# EAGLE schematic preliminarySchematic (EAGLE 9.6.2)
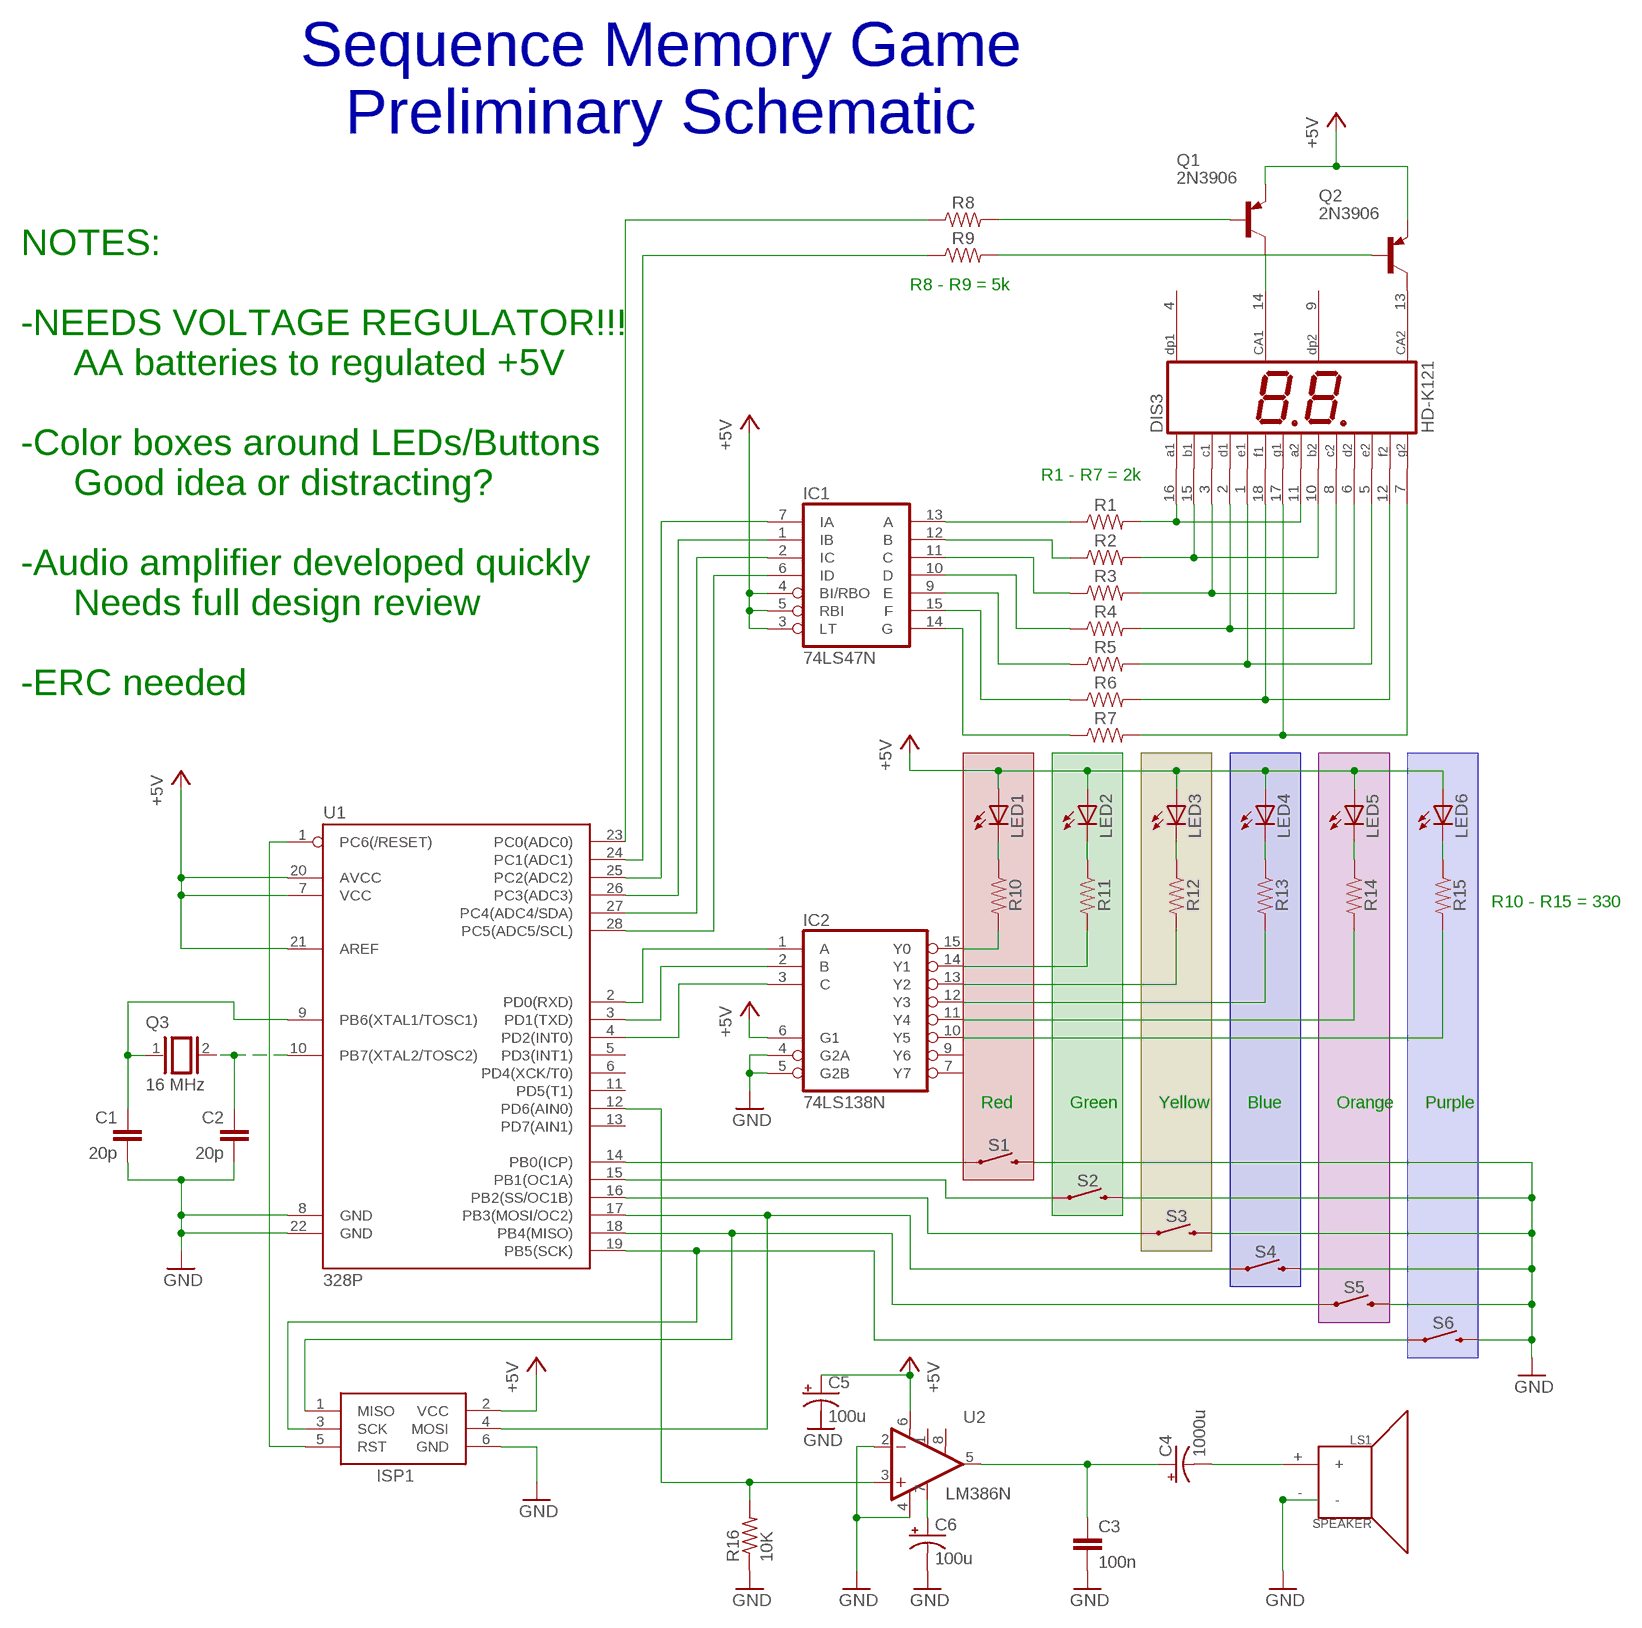
[diagram p0: schematic, sheet 1]

## Parts
C1  20p  C2,5-3  [C2.5-3]
C2  20p  C2,5-3  [C2.5-3]
C3  100n  C2,5-3  [C2.5-3]
C4  1000u  CPOL-USE5-10.5  [E5-10,5]
C5  100u  CPOL-USE2.5-6  [E2,5-6]
C6  100u  CPOL-USE2.5-6  [E2,5-6]
DIS3  HD-K121  [HDSP-R]
IC1  74LS47N  [DIL16]
IC2  74LS138N  [DIL16]
ISP1  AVRISP-6  [AVRISP]
LED1  LED5MM  [LED5MM]
LED2  LED5MM  [LED5MM]
LED3  LED5MM  [LED5MM]
LED4  LED5MM  [LED5MM]
LED5  LED5MM  [LED5MM]
LED6  LED5MM  [LED5MM]
LS1  SPEAKER  [PCB_MOUNT_SPEAKER]
Q1  2N3906  [TO92]
Q2  2N3906  [TO92]
Q3  XTAL/S  [QS]
R1  RESISTORAXIAL-0.3  [AXIAL-0.3]
R2  RESISTORAXIAL-0.3  [AXIAL-0.3]
R3  RESISTORAXIAL-0.3  [AXIAL-0.3]
R4  RESISTORAXIAL-0.3  [AXIAL-0.3]
R5  RESISTORAXIAL-0.3  [AXIAL-0.3]
R6  RESISTORAXIAL-0.3  [AXIAL-0.3]
R7  RESISTORAXIAL-0.3  [AXIAL-0.3]
R8  RESISTORAXIAL-0.3  [AXIAL-0.3]
R9  RESISTORAXIAL-0.3  [AXIAL-0.3]
R10  RESISTORAXIAL-0.3  [AXIAL-0.3]
R11  RESISTORAXIAL-0.3  [AXIAL-0.3]
R12  RESISTORAXIAL-0.3  [AXIAL-0.3]
R13  RESISTORAXIAL-0.3  [AXIAL-0.3]
R14  RESISTORAXIAL-0.3  [AXIAL-0.3]
R15  RESISTORAXIAL-0.3  [AXIAL-0.3]
R16  10K  R-US_0204/5  [0204/5]
S1  MOMENTARY-SWITCH-SPST-PTH-6.0MM  [TACTILE_SWITCH_PTH_6.0MM]
S2  MOMENTARY-SWITCH-SPST-PTH-6.0MM  [TACTILE_SWITCH_PTH_6.0MM]
S3  MOMENTARY-SWITCH-SPST-PTH-6.0MM  [TACTILE_SWITCH_PTH_6.0MM]
S4  MOMENTARY-SWITCH-SPST-PTH-6.0MM  [TACTILE_SWITCH_PTH_6.0MM]
S5  MOMENTARY-SWITCH-SPST-PTH-6.0MM  [TACTILE_SWITCH_PTH_6.0MM]
S6  MOMENTARY-SWITCH-SPST-PTH-6.0MM  [TACTILE_SWITCH_PTH_6.0MM]
U1  328P  ATMEGA328P_PDIP  [DIP28]
U2  LM386N  LM386  [DIP08]

## Nets
+5V: C5.+ IC1.3(LT) IC1.4(BI/RBO) IC1.5(RBI) IC2.6(G1) ISP1.2(VCC) LED1.A LED2.A LED3.A LED4.A LED5.A LED6.A Q1.3(E) Q2.3(E) U1.7(VCC) U1.20(AVCC) U1.21(AREF) U2.6(V+)
GND: C1.2 C2.2 C3.2 C6.- IC2.4(G2A) IC2.5(G2B) ISP1.6(GND) LS1.- R16.1 S1.3 S2.3 S3.3 S4.3 S5.3 S6.3 U1.8(GND) U1.22(GND) U2.2(-IN) U2.4(V-)
N$1: DIS3.10(B2) DIS3.11(A2) DIS3.16(A1) R1.P$2 R2.P$2
N$2: DIS3.15(B1)
N$3: DIS3.3(C1) DIS3.8(C2) R3.P$2
N$4: DIS3.2(D1) DIS3.6(D2) R4.P$2
N$5: DIS3.1(E1) DIS3.5(E2) R5.P$2
N$6: DIS3.7(G2) DIS3.12(F2) DIS3.17(G1) DIS3.18(F1) IC1.14(G) IC1.15(F) R6.P$1 R6.P$2 R7.P$1 R7.P$2
N$7: IC1.13(A) R1.P$1
N$8: IC1.12(B) R2.P$1
N$9: IC1.11(C) R3.P$1
N$10: IC1.10(D) R4.P$1
N$11: IC1.9(E) R5.P$1
N$12: DIS3.14(CA1) Q1.1(C)
N$13: DIS3.13(CA2) Q2.1(C)
N$14: Q1.2(B) R8.P$2
N$15: Q2.2(B) R9.P$2
N$16: C2.1 Q3.2 U1.10(PB7(XTAL2/TOSC2))
N$17: IC2.15(Y0) R10.P$2
N$18: IC2.14(Y1) R11.P$2
N$19: IC2.13(Y2) R12.P$2
N$20: IC2.12(Y3) R13.P$2
N$21: IC2.11(Y4) R14.P$2
N$22: IC2.10(Y5) R15.P$2
N$23: C1.1 Q3.1 U1.9(PB6(XTAL1/TOSC1))
N$24: LED1.K(C) R10.P$1
N$25: LED2.K(C) R11.P$1
N$26: LED3.K(C) R12.P$1
N$27: LED4.K(C) R13.P$1
N$28: LED5.K(C) R14.P$1
N$29: LED6.K(C) R15.P$1
N$31: S1.1 U1.14(PB0(ICP))
N$32: R16.2 U1.12(PD6(AIN0)) U2.3(+IN)
N$33: ISP1.3(SCK) S6.1 U1.19(PB5(SCK))
N$34: ISP1.5(RST) U1.1(PC6(/RESET))
N$35: IC2.1(A) U1.2(PD0(RXD))
N$36: IC2.3(C) U1.4(PD2(INT0))
N$37: ISP1.1(MISO) S5.1 U1.18(PB4(MISO))
N$38: S2.1 U1.15(PB1(OC1A))
N$39: IC2.2(B) U1.3(PD1(TXD))
N$40: C6.+ U2.7(BP)
N$41: S3.1 U1.16(PB2(SS/OC1B))
N$42: R8.P$1 U1.23(PC0(ADC0))
N$43: ISP1.4(MOSI) S4.1 U1.17(PB3(MOSI/OC2))
N$44: R9.P$1 U1.24(PC1(ADC1))
N$45: IC1.7(IA) U1.25(PC2(ADC2))
N$46: C3.1 C4.+ U2.5(OUT)
N$47: IC1.1(IB) U1.26(PC3(ADC3))
N$48: IC1.2(IC) U1.27(PC4(ADC4/SDA))
N$49: IC1.6(ID) U1.28(PC5(ADC5/SCL))
N$50: C4.- LS1.+
Unconnected: C5.- DIS3.4(DP1) DIS3.9(DP2) IC2.7(Y7) IC2.9(Y6) U1.5(PD3(INT1)) U1.6(PD4(XCK/T0)) U1.11(PD5(T1)) U1.13(PD7(AIN1)) U2.1(GAIN) U2.8(GAIN)

## Notes on the sheet
- Sequence Memory Game
  Preliminary Schematic
- R8 - R9 = 5k
- R1 - R7 = 2k
- NOTES:
  
  -NEEDS VOLTAGE REGULATOR!!!
       AA batteries to regulated +5V
  
  -Color boxes around LEDs/Buttons
       Good idea or distracting?
  
  -Audio amplifier developed quickly
       Needs full design review
  
  -ERC needed
- R10 - R15 = 330
- Red | Green | Yellow | Blue | Orange | Purple

## Power pins joined to a net without a drawn wire
GND: IC1.8(GND) IC2.8(GND)
VCC: IC1.16(VCC) IC2.16(VCC)

## Library data of the parts
C1-C3 = capacitor-wima:C: CAPACITOR naming: grid - package width
C4-C6 = rcl:CPOL-US: POLARIZED CAPACITOR, American symbol; SPICEPREFIX: C
DIS3 = display-hp:HD-K121: LED DISPLAY 2 x 1 character 7 segment, decimal points right; OC_FARNELL: unknown; OC_NEWARK: unknown
IC1 = 74xx-us:74*47: BCD to seven segment DECODER/DRIVER Source: http://www.ee.washington.edu/stores/DataSheets/74ls/74ls47.pdf
IC2 = 74xx-us:74*138: 3-line to 8-line DECODER/DEMULTIPLEXER
ISP1 = adafruit:AVRISP: AVR ISP HEADER Standard 6 pin header for AVR programming
LED1-LED6 = adafruit:LED: LED OSRAM: - CHIPLED LG R971, LG N971, LY N971, LG Q971, LY Q971, LO R971, LY R971 LH N974, LH R974 LS Q976, LO Q976, LY Q976 LO Q996 - Hyper CHIPLED LW Q18S LB Q993, LB Q99A, LB R99A - SideLED LS A670, LO A670, LY A670, LG A670, LP A670 LB A673, LV A673, LT A673, LW A673 LH A674 LY A675 LS A676, LA A676, LO A676, LY A676, LW A676 LS A679, LY A679, LG A679 - Hyper Micro SIDELED® LS Y876, LA Y876, LO Y876, LY Y876 LT Y87S - SmartLED LW L88C, LW L88S LB L89C, LB L89S, LG L890 LS L89K, LO L89K, LY L89K LS L896, LA L896, LO L896, LY L896 - TOPLED LS T670, LO T670, LY T670, LG T670, LP T670 LSG T670, LSP T670, LSY T670, LOP T670, LYG T670 LG T671, LOG T671, LSG T671 LB T673, LV T673, LT T673, LW T673 LH T674 LS T676, LA T676, LO T676, LY T676, LB T676, LH T676, LSB T676, LW T676 LB T67C, LV T67C, LT T67C, LS T67K, LO T67K, LY T67K, LW E67C LS E67B, LA E67B, LO E67B, LY E67B, LB E67C, LV E67C, LT E67C LW T67C LS T679, LY T679, LG T679 LS T770, LO T770, LY T770, LG T770, LP T770 LB T773, LV T773, LT T773, LW T773 LH T774 LS E675, LA E675, LY E675, LS T675 LS T776, LA T776, LO T776, LY T776, LB T776 LHGB T686 LT T68C, LB T68C - Hyper Mini TOPLED® LB M676 - Mini TOPLED Santana® LG M470 LS M47K, LO M47K, LY M47K Source: http://www.osram.convergy.de/
LS1 = SparkFun-Electromechanical:SPEAKER: Speaker Generic 2-terminal loudspeakers SparkFun Products Speaker - PCB Mount <https://www.sparkfun.com/products/11089> (COM-11089); PROD_ID: COMP-11789; SF_SKU: COM-11089
Q1 Q2 = transistor-pnp:2N3906: PNP Transistor
Q3 = special:XTAL/S: CRYSTAL
R1 = SparkFun-Resistors:RESISTOR: Generic Resistor Package; PROD_ID: 2k
R2-R15 = SparkFun-Resistors:RESISTOR: Generic Resistor Package
R16 = rcl:R-US_: RESISTOR, American symbol; SPICEPREFIX: R
S1-S6 = SparkFun-Switches:MOMENTARY-SWITCH-SPST: Momentary Switch (Pushbutton) - SPST Normally-open (NO) SPST momentary switches (buttons, pushbuttons). Variants PTH-12MM - 12mm square, through-hole Momentary Pushbutton Switch - 12mm Square <https://www.sparkfun.com/products/9190> (COM-09190) PTH-6.0MM, PTH-6.0MM-KIT - 6.0mm square, through-hole Mini Pushbutton Switch <https://www.sparkfun.com/products/97> (COM-00097) KIT package intended for soldering kit's - only one side of pads' copper is exposed. PTH-RIGHT-ANGLE-KIT - Right-angle, through-hole Right Angle Tactile Button <https://www.sparkfun.com/products/10791> - Used on SparkFun BigTime Watch Kit <https://www.sparkfun.com/products/11734> SMD-12MM - 12mm square, surface-mount Tactile Button - SMD (12mm) <https://www.sparkfun.com/products/12993> (COM-12993) Used on SparkFun PicoBoard <https://www.sparkfun.com/products/11888> SMD-4.5MM - 4.5mm Square Trackball Switch Used on SparkFun Blackberry Trackballer Breakout <https://www.sparkfun.com/products/13169> SMD-4.6MMX2.8MM - 4.60mm x 2.80mm, surface mount Used on SparkFun SAMD21 Mini Breakout <https://www.sparkfun.com/products/13664> SMD-5.2MM, SMD-5.2-REDUNDANT - 5.2mm square, surface-mount Mini Pushbutton Switch - SMD <https://www.sparkfun.com/products/8720> (COM-08720) Used on Arduino Pro Mini <https://www.sparkfun.com/products/11114> REDUNDANT package connects both switch circuits together SMD-6.0X3.5MM - 6.0 x 3.5mm, surface mount Momentary Reset Switch SMD <https://www.sparkfun.com/products/8229> (COM-08229) SMD-6.2MM-TALL - 6.2mm square, surface mount Tactile Button - SMD (6mm) <https://www.sparkfun.com/products/12992> Used on SparkFun Digital Sandbox <https://www.sparkfun.com/products/12651> SMD-RIGHT-ANGLE - Right-angle, surface mount Used on SparkFun Block for Intel® Edison - Arduino <https://www.sparkfun.com/products/13036>; PROD_ID: SWCH-08441; SF_SKU: COM-00097
U1 = SparkFun-IC-Microcontroller:ATMEGA328P_PDIP: Atmel 328P Through hole ATMEGA328P uC used in the Arduino 32kb flash, 1k EEPROM, 2k SRAM Datasheet <http://www.sparkfun.com/datasheets/Components/SMD/ATMega328.pdf> SparkFun Products Storefront component: AVR 28 Pin 20MHz 32K 6A/D - ATMega328P <https://www.sparkfun.com/products/9061> (COM-09061) SparkFun Simon Says - Through-Hole Soldering Kit <https://www.sparkfun.com/products/10547> (KIT-10547) SparkFun Learn to Solder - Simon Says <https://www.sparkfun.com/products/13708> (KIT-13708) SparkFun BigTime Watch Kit <https://www.sparkfun.com/products/11734> (KIT-11734) SparkFun ClockIt <https://www.sparkfun.com/products/10930> (KIT-10930) SparkFun Serial Enabled LCD Kit <https://www.sparkfun.com/products/10097> (LCD-10097) SparkFun Simon Tilts - Through Hole Soldering Kit <https://www.sparkfun.com/products/12634> (KIT-12634) SparkFun Frequency Counter Kit <https://www.sparkfun.com/products/10140> (KIT-10140) FabFM Radio Kit <https://www.sparkfun.com/products/11043> (KIT-11043) SparkFun Binary Blaster Kit <https://www.sparkfun.com/products/12037> (KIT-12037) SparkFun Metro-Gnome <https://www.sparkfun.com/products/9236> (KIT-09236) ATmega328 with Arduino Optiboot (Uno) <https://www.sparkfun.com/products/10524> (DEV-10524); PROD_ID: IC-09136
U2 = SparkFun-IC-Amplifiers:LM386: low voltage audio power amplifier SparkFun Products FabFM Radio Kit <https://www.sparkfun.com/products/11043> (KIT-11043); PROD_ID: IC-10899